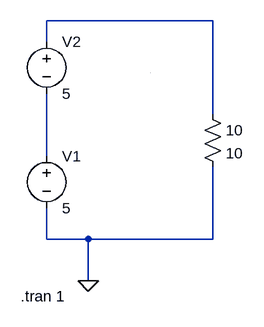
[diagram p0: schematic 2.asc]
2.asc, the LTspice schematic file:
Version 4
SHEET 1 880 680
WIRE 96 -80 -160 -80
WIRE -160 -48 -160 -80
WIRE 96 64 96 -80
WIRE -160 128 -160 32
WIRE -160 256 -160 208
WIRE -96 256 -160 256
WIRE 96 256 96 144
WIRE 96 256 -96 256
WIRE -96 320 -96 256
WIRE 0 0 0 0
FLAG -96 320 0
SYMBOL voltage -160 112 R0
WINDOW 123 0 0 Left 0
WINDOW 39 0 0 Left 0
SYMATTR InstName V1
SYMATTR Value 5
SYMBOL voltage -160 -64 R0
WINDOW 123 0 0 Left 0
WINDOW 39 0 0 Left 0
SYMATTR InstName V2
SYMATTR Value 5
SYMBOL res 80 48 R0
SYMATTR InstName 10
SYMATTR Value 10
TEXT -200 344 Left 2 !.tran 1

The netlist it stands for:
* 2.asc
V1 N002 0 5
V2 N001 N002 5
R§10 N001 0 10
.tran 1
.backanno
.end